# Altium schematic sheet SH20 - SD_MMC.SchDoc
size 386 x 246 mm
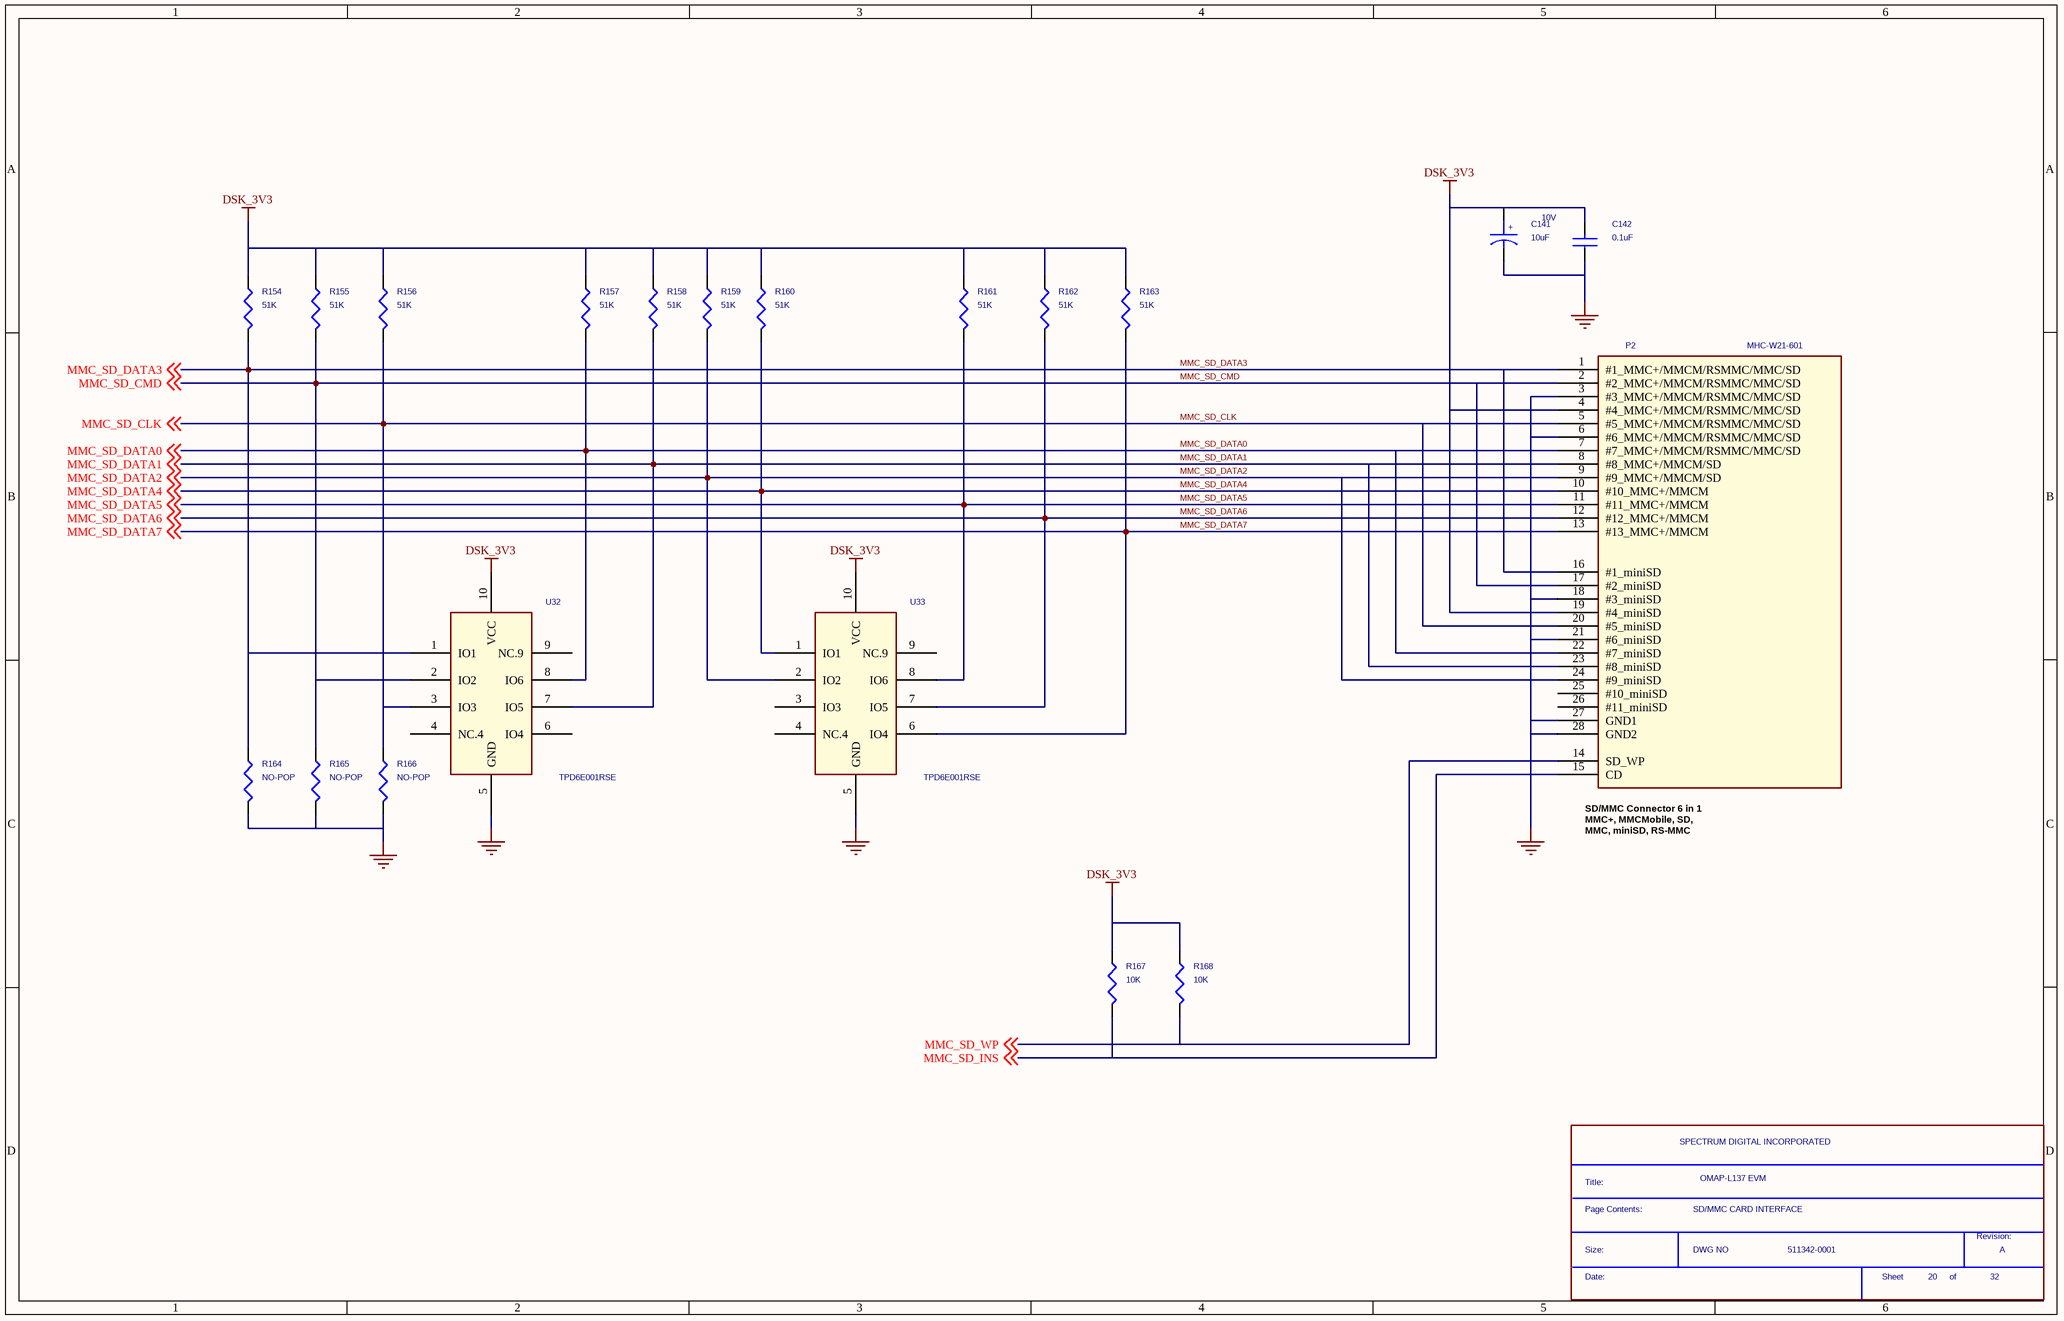
[diagram p0: SH20 - SD_MMC.SchDoc]

## Parts
*  Page Contents:: SD/MMC CARD INTERFACE  RevCode: A  Title: OMAP-L137 EVM  OrgName: SPECTRUM DIGITAL INCORPORATED  Doc: 511342-0001  Page Number: 20  Page Count: 32  (hidden comment: SDTitleBlock)  (graphical)
C141  10uF  [SM-PCAP-3216]
C142  0.1uF  Voltage: 10V  [SM-CAP-0402]
P2  MHC-W21-601  [SM-CON-MOLEX-54794-0918]
R154  51K  [r603-35X45]
R155  51K  [r603-35X45]
R156  51K  [r603-35X45]
R157  51K  [r603-35X45]
R158  51K  [r603-35X45]
R159  51K  [r603-35X45]
R160  51K  [r603-35X45]
R161  51K  [r603-35X45]
R162  51K  [r603-35X45]
R163  51K  [r603-35X45]
R164  NO-POP  [r402-25]
R165  NO-POP  [r402-25]
R166  NO-POP  [r402-25]
R167  10K  [SM-RES-0402]
R168  10K  [SM-RES-0402]
U32  TPD6E001RSE  [rse10]
U33  TPD6E001RSE  [rse10]

## Nets
DSK_3V3: C141.1(P) C142.2 P2.4(#4_MMC+/MMCM/RSMMC/MMC/SD) P2.19(#4_miniSD) R154.1 R155.1 R156.1 R157.1 R158.1 R159.1 R160.1 R161.1 R162.1 R163.1 R167.2(P2) R168.2(P2) U32.10(VCC) U33.10(VCC)
GND: C141.2(M) C142.1 P2.3(#3_MMC+/MMCM/RSMMC/MMC/SD) P2.6(#6_MMC+/MMCM/RSMMC/MMC/SD) P2.18(#3_miniSD) P2.21(#6_miniSD) P2.27(GND1) P2.28(GND2) R164.2 R165.2 R166.2 U32.5(GND) U33.5(GND)
MMC_SD_CLK: P2.5(#5_MMC+/MMCM/RSMMC/MMC/SD) P2.20(#5_miniSD) R156.2 R166.1 U32.3(IO3) ; off-sheet MMC_SD_CLK
MMC_SD_CMD: P2.2(#2_MMC+/MMCM/RSMMC/MMC/SD) P2.17(#2_miniSD) R155.2 R165.1 U32.2(IO2) ; off-sheet MMC_SD_CMD
MMC_SD_DATA0: P2.7(#7_MMC+/MMCM/RSMMC/MMC/SD) P2.22(#7_miniSD) R157.2 U32.8(IO6) ; off-sheet MMC_SD_DATA0
MMC_SD_DATA1: P2.8(#8_MMC+/MMCM/SD) P2.23(#8_miniSD) R158.2 U32.7(IO5) ; off-sheet MMC_SD_DATA1
MMC_SD_DATA2: P2.9(#9_MMC+/MMCM/SD) P2.24(#9_miniSD) R159.2 U33.2(IO2) ; off-sheet MMC_SD_DATA2
MMC_SD_DATA3: P2.1(#1_MMC+/MMCM/RSMMC/MMC/SD) P2.16(#1_miniSD) R154.2 R164.1 U32.1(IO1) ; off-sheet MMC_SD_DATA3
MMC_SD_DATA4: P2.10(#10_MMC+/MMCM) R160.2 U33.1(IO1) ; off-sheet MMC_SD_DATA4
MMC_SD_DATA5: P2.11(#11_MMC+/MMCM) R161.2 U33.8(IO6) ; off-sheet MMC_SD_DATA5
MMC_SD_DATA6: P2.12(#12_MMC+/MMCM) R162.2 U33.7(IO5) ; off-sheet MMC_SD_DATA6
MMC_SD_DATA7: P2.13(#13_MMC+/MMCM) R163.2 U33.6(IO4) ; off-sheet MMC_SD_DATA7
MMC_SD_INS: P2.15(CD) R167.1(P1) ; off-sheet MMC_SD_INS
MMC_SD_WP: P2.14(SD_WP) R168.1(P1) ; off-sheet MMC_SD_WP

Not connected (* = marked no-connect by the designer): P2 25(#10_miniSD) 26(#11_miniSD); U32 4(NC.4) 6(IO4) 9(NC.9); U33 3(IO3) 4(NC.4) 9(NC.9)

## Notes on the sheet
- (near P2) SD/MMC Connector 6 in 1
  MMC+, MMCMobile, SD,
  MMC, miniSD, RS-MMC
- (in symbol 10UF-10V-293D-C_1) +
- (in symbol SDTitleBlock) Title:; Page Contents:; Revision:; Size:; DWG NO; Date:; Sheet; of

## Library data of the parts
C141 = 10UF-10V-293D-C_1: Part #: 101003-0101R; CLASS: DISCRETE; DIS-V: RS; REF DIS-V: 100-2221; MAN: VISHAY-SPRAGUE; DES: 10UF,10V, Size B; PN: 293D106X9016C; RAT: 10V; PUR: SUB; TOL: 10%; TN: 208-0037-000
C142 = 0402_0r1uf_x7r_10v_10: Part #: 101587-1100R; TN: 207-0068-000; Desc: CAP, CER, X7R, 0402, 10V, 10%, 0.1uF
P2 = MMC4_2.0_CONN: Manufacturer: OMRON; Part #: 102710-0001R; ATLStockNo1: 4500.0144; TN: 224-0332-000
R154-R163 = R_1: Part #: 100687-5103R
R164-R166 = R_1: Part #: R0402-NOPOP
R167 R168 = RES_0: Part #: 101370-1003R; CLASS: DISCRETE; TN: 272-0029-000; TOL: 1%; RATING: 0.063W
U32 U33 = TPDE0001RSE: Part #: 102566-0001R